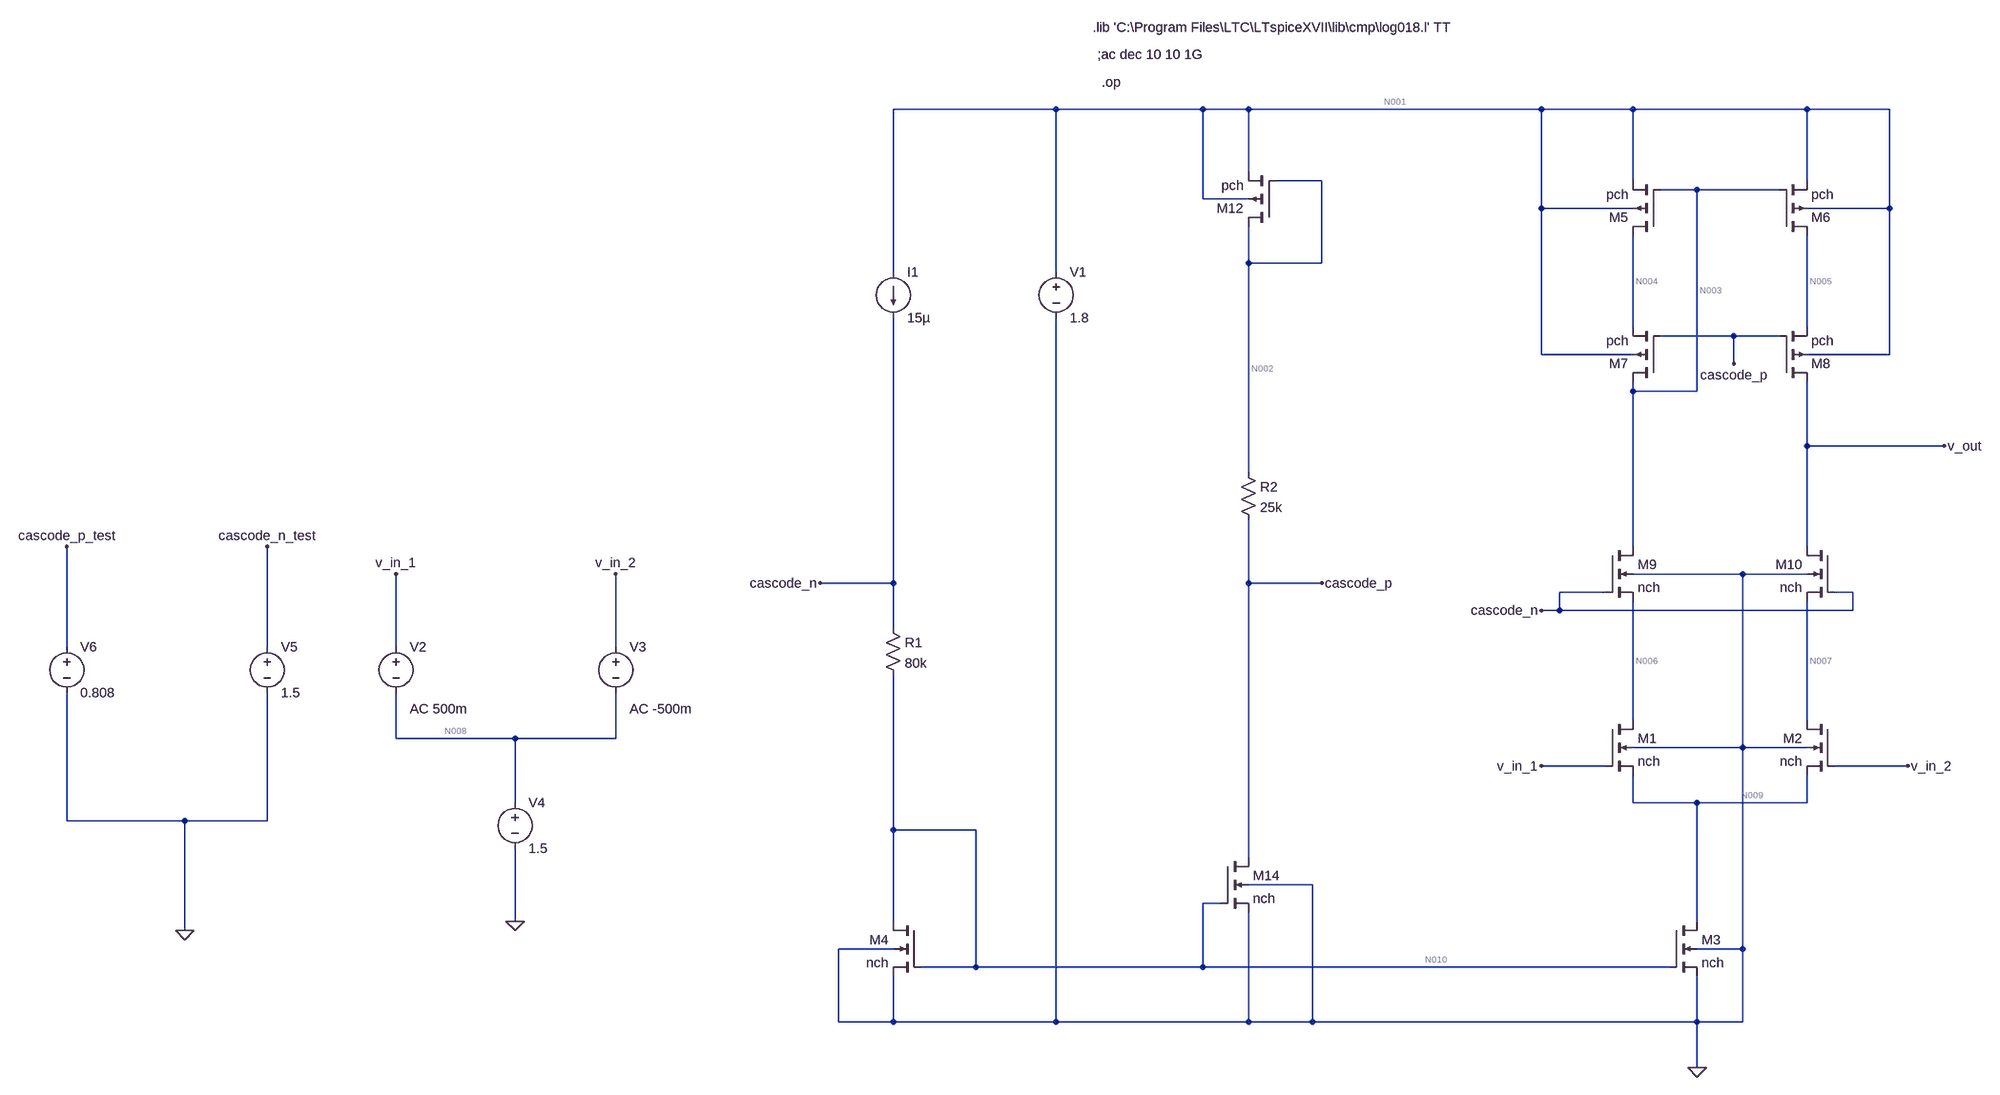
[diagram p0: schematic differential-pair-current-mirror.asc]
differential-pair-current-mirror.asc, the LTspice schematic file:
Version 4
SHEET 1 1744 1748
WIRE -400 48 -688 48
WIRE -144 48 -400 48
WIRE -64 48 -144 48
WIRE 448 48 -64 48
WIRE 608 48 448 48
WIRE 912 48 608 48
WIRE 1056 48 912 48
WIRE -64 160 -64 48
WIRE 64 176 -16 176
WIRE 608 176 608 48
WIRE 912 176 912 48
WIRE 720 192 656 192
WIRE 864 192 720 192
WIRE -144 208 -144 48
WIRE -64 208 -144 208
WIRE 448 224 448 48
WIRE 608 224 448 224
WIRE 1056 224 1056 48
WIRE 1056 224 912 224
WIRE -64 320 -64 256
WIRE 64 320 64 176
WIRE 64 320 -64 320
WIRE -688 336 -688 48
WIRE -400 336 -400 48
WIRE 608 432 608 272
WIRE 912 432 912 272
WIRE 784 448 656 448
WIRE 864 448 784 448
WIRE 448 480 448 224
WIRE 608 480 448 480
WIRE 1056 480 1056 224
WIRE 1056 480 912 480
WIRE 784 496 784 448
WIRE 608 544 608 528
WIRE 720 544 720 192
WIRE 720 544 608 544
WIRE 912 640 912 528
WIRE 1152 640 912 640
WIRE -64 688 -64 320
WIRE 608 816 608 544
WIRE 912 816 912 640
WIRE 800 864 608 864
WIRE 912 864 800 864
WIRE -688 880 -688 416
WIRE -688 880 -816 880
WIRE -64 880 -64 768
WIRE 64 880 -64 880
WIRE 560 896 480 896
WIRE 992 896 960 896
WIRE 480 928 480 896
WIRE 480 928 448 928
WIRE 992 928 992 896
WIRE 992 928 480 928
WIRE -688 960 -688 880
WIRE -2544 992 -2544 816
WIRE -2192 992 -2192 816
WIRE -1872 992 -1872 864
WIRE -1488 992 -1488 864
WIRE 608 1120 608 912
WIRE 912 1120 912 912
WIRE -1872 1152 -1872 1072
WIRE -1664 1152 -1872 1152
WIRE -1488 1152 -1488 1072
WIRE -1488 1152 -1664 1152
WIRE 800 1168 800 864
WIRE 800 1168 608 1168
WIRE 912 1168 800 1168
WIRE 560 1200 448 1200
WIRE 1088 1200 960 1200
WIRE -1664 1264 -1664 1152
WIRE 608 1264 608 1216
WIRE 720 1264 608 1264
WIRE 912 1264 912 1216
WIRE 912 1264 720 1264
WIRE -2544 1296 -2544 1072
WIRE -2336 1296 -2544 1296
WIRE -2192 1296 -2192 1072
WIRE -2192 1296 -2336 1296
WIRE -688 1312 -688 1040
WIRE -544 1312 -688 1312
WIRE -64 1360 -64 880
WIRE 48 1408 -64 1408
WIRE -112 1440 -144 1440
WIRE -1664 1472 -1664 1344
WIRE -688 1472 -688 1312
WIRE 720 1472 720 1264
WIRE -2336 1488 -2336 1296
WIRE -688 1520 -784 1520
WIRE 800 1520 800 1168
WIRE 800 1520 720 1520
WIRE -544 1552 -544 1312
WIRE -544 1552 -640 1552
WIRE -144 1552 -144 1440
WIRE -144 1552 -544 1552
WIRE 672 1552 -144 1552
WIRE -784 1648 -784 1520
WIRE -688 1648 -688 1568
WIRE -688 1648 -784 1648
WIRE -400 1648 -400 416
WIRE -400 1648 -688 1648
WIRE -64 1648 -64 1456
WIRE -64 1648 -400 1648
WIRE 48 1648 48 1408
WIRE 48 1648 -64 1648
WIRE 720 1648 720 1568
WIRE 720 1648 48 1648
WIRE 800 1648 800 1520
WIRE 800 1648 720 1648
WIRE 720 1728 720 1648
FLAG 720 1728 0
FLAG -1664 1472 0
FLAG 448 1200 v_in_1
FLAG 1088 1200 v_in_2
FLAG -1872 864 v_in_1
FLAG -1488 864 v_in_2
FLAG 1152 640 v_out
FLAG 784 496 cascode_p
FLAG 448 928 cascode_n
FLAG -2544 816 cascode_p_test
FLAG -2192 816 cascode_n_test
FLAG -2336 1488 0
FLAG -816 880 cascode_n
FLAG 64 880 cascode_p
DATAFLAG 784 448 ""
DATAFLAG 512 1200 ""
DATAFLAG 1040 1200 ""
DATAFLAG 768 1264 ""
DATAFLAG 512 896 ""
DATAFLAG 624 1552 ""
DATAFLAG -640 1312 ""
DATAFLAG 608 592 ""
DATAFLAG 912 592 ""
DATAFLAG 608 1024 ""
DATAFLAG 608 352 ""
DATAFLAG 912 336 ""
DATAFLAG 912 1024 ""
DATAFLAG -688 1456 "Id(M4)"
DATAFLAG 720 1392 "Id(M3)"
DATAFLAG -64 1264 "Id(M14)"
DATAFLAG -688 656 ""
DATAFLAG 768 48 ""
DATAFLAG -64 448 ""
DATAFLAG -64 1040 ""
DATAFLAG 608 752 "Id(M9)"
DATAFLAG 912 752 "Id(M10)"
SYMBOL nmos4 560 1120 R0
SYMATTR InstName M1
SYMATTR Value nch
SYMATTR Value2 l=1u w=15u
SYMBOL nmos4 960 1120 M0
SYMATTR InstName M2
SYMATTR Value nch
SYMATTR Value2 l=1u w=15u
SYMBOL nmos4 672 1472 R0
SYMATTR InstName M3
SYMATTR Value nch
SYMATTR Value2 l=1u w=30u
SYMBOL nmos4 -640 1472 M0
SYMATTR InstName M4
SYMATTR Value nch
SYMATTR Value2 l=1u w=15u
SYMBOL pmos4 656 272 R180
SYMATTR InstName M5
SYMATTR Value pch
SYMATTR Value2 l=1u w=30u
SYMBOL pmos4 864 272 M180
SYMATTR InstName M6
SYMATTR Value pch
SYMATTR Value2 l=1u w=30u
SYMBOL current -688 336 R0
SYMATTR InstName I1
SYMATTR Value 15µ
SYMBOL voltage -400 320 R0
WINDOW 123 0 0 Left 0
WINDOW 39 0 0 Left 0
SYMATTR InstName V1
SYMATTR Value 1.8
SYMBOL voltage -1872 976 R0
WINDOW 123 24 124 Left 2
WINDOW 39 0 0 Left 0
SYMATTR Value2 AC 500m
SYMATTR InstName V2
SYMATTR Value ""
SYMBOL voltage -1664 1248 R0
WINDOW 123 0 0 Left 0
WINDOW 39 0 0 Left 0
SYMATTR InstName V4
SYMATTR Value 1.5
SYMBOL voltage -1488 976 R0
WINDOW 123 24 124 Left 2
WINDOW 39 0 0 Left 0
SYMATTR Value2 AC -500m
SYMATTR InstName V3
SYMATTR Value ""
SYMBOL pmos4 656 528 R180
SYMATTR InstName M7
SYMATTR Value pch
SYMATTR Value2 l=1u w=30u
SYMBOL pmos4 864 528 M180
SYMATTR InstName M8
SYMATTR Value pch
SYMATTR Value2 l=1u w=30u
SYMBOL nmos4 560 816 R0
SYMATTR InstName M9
SYMATTR Value nch
SYMATTR Value2 l=1u w=15u
SYMBOL nmos4 960 816 M0
SYMATTR InstName M10
SYMATTR Value nch
SYMATTR Value2 l=1u w=15u
SYMBOL voltage -2192 976 R0
WINDOW 123 0 0 Left 0
WINDOW 39 0 0 Left 0
SYMATTR InstName V5
SYMATTR Value 1.5
SYMBOL voltage -2544 976 R0
WINDOW 123 0 0 Left 0
WINDOW 39 0 0 Left 0
SYMATTR InstName V6
SYMATTR Value 0.808
SYMBOL pmos4 -16 256 R180
SYMATTR InstName M12
SYMATTR Value pch
SYMATTR Value2 l=1u w=30u
SYMBOL nmos4 -112 1360 R0
SYMATTR InstName M14
SYMATTR Value nch
SYMATTR Value2 l=1u w=15u
SYMBOL res -704 944 R0
SYMATTR InstName R1
SYMATTR Value 80k
SYMBOL res -80 672 R0
SYMATTR InstName R2
SYMATTR Value 25k
TEXT -336 -96 Left 2 !.lib 'C:\\Program Files\\LTC\\LTspiceXVII\\lib\\cmp\\log018.l' TT
TEXT -328 -48 Left 2 !;ac dec 10 10 1G
TEXT -320 0 Left 2 !.op

The netlist it stands for:
* differential-pair-current-mirror.asc
M1 N006 v_in_1 N009 0 nch l=1u w=15u
M2 N007 v_in_2 N009 0 nch l=1u w=15u
M3 N009 N010 0 0 nch l=1u w=30u
M4 N010 N010 0 0 nch l=1u w=15u
M5 N004 N003 N001 N001 pch l=1u w=30u
M6 N005 N003 N001 N001 pch l=1u w=30u
I1 N001 cascode_n 15µ
V1 N001 0 1.8
V2 v_in_1 N008 AC 500m
V4 N008 0 1.5
V3 v_in_2 N008 AC -500m
M7 N003 cascode_p N004 N001 pch l=1u w=30u
M8 v_out cascode_p N005 N001 pch l=1u w=30u
M9 N003 cascode_n N006 0 nch l=1u w=15u
M10 v_out cascode_n N007 0 nch l=1u w=15u
V5 cascode_n_test 0 1.5
V6 cascode_p_test 0 0.808
M12 N002 N002 N001 N001 pch l=1u w=30u
M14 cascode_p N010 0 0 nch l=1u w=15u
R1 cascode_n N010 80k
R2 N002 cascode_p 25k
.model NMOS NMOS
.model PMOS PMOS
.lib standard.mos
.lib 'C:\Program Files\LTC\LTspiceXVII\lib\cmp\log018.l' TT
;ac dec 10 10 1G
.op
.backanno
.end

* Results of the author's LTspice run, read from the files saved beside the schematic
* Operating Point:
*   V(n006) = 967.4 mV
*   V(v_in_1) = 1.5 V
*   V(n009) = 801 mV
*   V(n007) = 967.4 mV
*   V(v_in_2) = 1.5 V
*   V(n010) = 499.4 mV
*   V(n004) = 1.508 V
*   V(n003) = 1.237 V
*   V(n001) = 1.8 V
*   V(n005) = 1.508 V
*   V(cascode_n) = 1.699 V
*   V(n008) = 1.5 V
*   V(cascode_p) = 855.3 mV
*   V(v_out) = 1.237 V
*   V(cascode_n_test) = 1.5 V
*   V(cascode_p_test) = 808 mV
*   V(n002) = 1.239 V
*   Id(M12) = -15.34 µA
*   Ig(M12) = 0 A
*   Ib(M12) = 571.1 fA
*   Is(M12) = 15.34 µA
*   Id(M8) = -15.36 µA
*   Ig(M8) = 0 A
*   Ib(M8) = 874.6 fA
*   Is(M8) = 15.36 µA
*   Id(M7) = -15.36 µA
*   Ig(M7) = 0 A
*   Ib(M7) = 874.6 fA
*   Is(M7) = 15.36 µA
*   Id(M6) = -15.36 µA
*   Ig(M6) = 0 A
*   Ib(M6) = 301.9 fA
*   Is(M6) = 15.36 µA
*   Id(M5) = -15.36 µA
*   Ig(M5) = 0 A
*   Ib(M5) = 301.9 fA
*   Is(M5) = 15.36 µA
*   Id(M14) = 15.34 µA
*   Ig(M14) = 0 A
*   Ib(M14) = -2.155 pA
*   Is(M14) = -15.34 µA
*   Id(M10) = 15.36 µA
*   Ig(M10) = 0 A
*   Ib(M10) = -2.225 pA
*   Is(M10) = -15.36 µA
*   Id(M9) = 15.36 µA
*   Ig(M9) = 0 A
*   Ib(M9) = -2.225 pA
*   Is(M9) = -15.36 µA
*   Id(M4) = 15 µA
*   Ig(M4) = 0 A
*   Ib(M4) = -509.4 fA
*   Is(M4) = -15 µA
*   Id(M3) = 30.72 µA
*   Ig(M3) = 0 A
*   Ib(M3) = -1.558 pA
*   Is(M3) = -30.72 µA
*   Id(M2) = 15.36 µA
*   Ig(M2) = 0 A
*   Ib(M2) = -1.788 pA
*   Is(M2) = -15.36 µA
*   Id(M1) = 15.36 µA
*   Ig(M1) = 0 A
*   Ib(M1) = -1.788 pA
*   Is(M1) = -15.36 µA
*   I(I1) = 15 µA
*   I(R2) = 15.34 µA
*   I(R1) = 15 µA
*   I(V6) = 0 A
*   I(V5) = 0 A
*   I(V3) = 0 A
*   I(V4) = 0 A
*   I(V2) = 0 A
*   I(V1) = -61.06 µA
* From the log:
*   Semiconductor Device Operating Points:
*                           --- BSIM3 MOSFETS ---
*   Name:        m12         m8          m7          m6          m5
*   Model:      pch.2       pch.2       pch.2       pch.2       pch.2
*   Id:       -1.53e-05   -1.54e-05   -1.54e-05   -1.54e-05   -1.54e-05
*   Vgs:      -5.61e-01   -6.53e-01   -6.53e-01   -5.63e-01   -5.63e-01
*   Vds:      -5.61e-01   -2.71e-01   -2.71e-01   -2.92e-01   -2.92e-01
*   Vbs:       0.00e+00    2.92e-01    2.92e-01    0.00e+00    0.00e+00
*   Vth:      -4.57e-01   -5.45e-01   -5.45e-01   -4.57e-01   -4.57e-01
*   Vdsat:    -1.28e-01   -1.33e-01   -1.33e-01   -1.29e-01   -1.29e-01
*   Gm:        1.97e-04    1.94e-04    1.94e-04    1.96e-04    1.96e-04
*   Gds:       8.96e-07    1.96e-06    1.96e-06    1.66e-06    1.66e-06
*   Gmb        6.44e-05    5.66e-05    5.66e-05    6.40e-05    6.40e-05
*   Cbd:       0.00e+00    0.00e+00    0.00e+00    0.00e+00    0.00e+00
*   Cbs:       0.00e+00    0.00e+00    0.00e+00    0.00e+00    0.00e+00
*   Cgsov:     9.83e-15    9.83e-15    9.83e-15    9.83e-15    9.83e-15
*   Cgdov:     9.83e-15    9.83e-15    9.83e-15    9.83e-15    9.83e-15
*   Cgbov:     2.73e-16    2.73e-16    2.73e-16    2.73e-16    2.73e-16
*   dQgdVgb:   1.93e-13    1.94e-13    1.94e-13    1.94e-13    1.94e-13
*   dQgdVdb:  -9.85e-15   -1.03e-14   -1.03e-14   -1.02e-14   -1.02e-14
*   dQgdVsb:  -1.69e-13   -1.73e-13   -1.73e-13   -1.70e-13   -1.70e-13
*   dQddVgb:  -1.02e-14   -1.19e-14   -1.19e-14   -1.15e-14   -1.15e-14
*   dQddVdb:   9.95e-15    1.10e-14    1.10e-14    1.07e-14    1.07e-14
*   dQddVsb:   3.63e-16    1.42e-15    1.42e-15    1.27e-15    1.27e-15
*   dQbdVgb:  -2.96e-14   -2.75e-14   -2.75e-14   -2.93e-14   -2.93e-14
*   dQbdVdb:  -2.27e-17   -2.79e-16   -2.79e-16   -2.18e-16   -2.18e-16
*   dQbdVsb:  -3.10e-14   -2.50e-14   -2.50e-14   -3.12e-14   -3.12e-14
*   Name:        m14         m10         m9          m4          m3
*   Model:      nch.2       nch.2       nch.2       nch.2       nch.2
*   Id:        1.53e-05    1.54e-05    1.54e-05    1.50e-05    3.07e-05
*   Vgs:       4.99e-01    7.32e-01    7.32e-01    4.99e-01    4.99e-01
*   Vds:       8.55e-01    2.70e-01    2.70e-01    4.99e-01    8.01e-01
*   Vbs:       0.00e+00   -9.67e-01   -9.67e-01    0.00e+00    0.00e+00
*   Vth:       4.81e-01    7.09e-01    7.09e-01    4.81e-01    4.81e-01
*   Vdsat:     9.47e-02    1.00e-01    1.00e-01    9.47e-02    9.48e-02
*   Gm:        2.63e-04    2.65e-04    2.65e-04    2.58e-04    5.27e-04
*   Gds:       9.01e-07    2.04e-06    2.04e-06    1.07e-06    1.83e-06
*   Gmb        7.60e-05    5.35e-05    5.35e-05    7.47e-05    1.53e-04
*   Cbd:       0.00e+00    0.00e+00    0.00e+00    0.00e+00    0.00e+00
*   Cbs:       0.00e+00    0.00e+00    0.00e+00    0.00e+00    0.00e+00
*   Cgsov:     5.49e-15    5.49e-15    5.49e-15    5.49e-15    1.10e-14
*   Cgdov:     5.49e-15    5.49e-15    5.49e-15    5.49e-15    1.10e-14
*   Cgbov:     1.81e-16    1.81e-16    1.81e-16    1.81e-16    1.81e-16
*   dQgdVgb:   7.03e-14    7.00e-14    7.00e-14    7.03e-14    1.41e-13
*   dQgdVdb:  -5.48e-15   -5.55e-15   -5.55e-15   -5.49e-15   -1.10e-14
*   dQgdVsb:  -4.81e-14   -5.33e-14   -5.33e-14   -4.81e-14   -9.66e-14
*   dQddVgb:  -5.53e-15   -5.91e-15   -5.91e-15   -5.60e-15   -1.11e-14
*   dQddVdb:   5.49e-15    5.62e-15    5.62e-15    5.51e-15    1.10e-14
*   dQddVsb:   4.37e-17    3.76e-16    3.76e-16    1.21e-16    9.99e-17
*   dQbdVgb:  -1.52e-14   -1.11e-14   -1.11e-14   -1.52e-14   -3.03e-14
*   dQbdVdb:   1.95e-18   -1.44e-17   -1.44e-17   -4.56e-19    3.69e-18
*   dQbdVsb:  -1.43e-14   -9.78e-15   -9.78e-15   -1.43e-14   -2.91e-14
*   Name:        m2          m1
*   Model:      nch.2       nch.2
*   Id:        1.54e-05    1.54e-05
*   Vgs:       6.99e-01    6.99e-01
*   Vds:       1.66e-01    1.66e-01
*   Vbs:      -8.01e-01   -8.01e-01
*   Vth:       6.75e-01    6.75e-01
*   Vdsat:     1.00e-01    1.00e-01
*   Gm:        2.61e-04    2.61e-04
*   Gds:       6.49e-06    6.49e-06
*   Gmb        5.53e-05    5.53e-05
*   Cbd:       0.00e+00    0.00e+00
*   Cbs:       0.00e+00    0.00e+00
*   Cgsov:     5.49e-15    5.49e-15
*   Cgdov:     5.49e-15    5.49e-15
*   Cgbov:     1.81e-16    1.81e-16
*   dQgdVgb:   7.11e-14    7.11e-14
*   dQgdVdb:  -5.76e-15   -5.76e-15
*   dQgdVsb:  -5.38e-14   -5.38e-14
*   dQddVgb:  -6.63e-15   -6.63e-15
*   dQddVdb:   6.02e-15    6.02e-15
*   dQddVsb:   8.49e-16    8.49e-16
*   dQbdVgb:  -1.13e-14   -1.13e-14
*   dQbdVdb:  -6.77e-17   -6.77e-17
*   dQbdVsb:  -1.05e-14   -1.05e-14